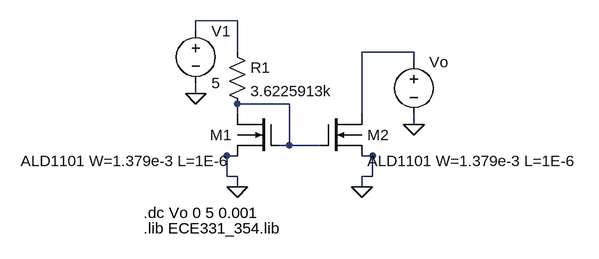
[diagram p0: schematic nmos_current_mirror_dc_out_swing.asc]
nmos_current_mirror_dc_out_swing.asc, the LTspice schematic file:
Version 4
SHEET 1 880 680
WIRE 112 -32 48 -32
WIRE 48 -16 48 -32
WIRE 112 16 112 -32
WIRE 384 16 304 16
WIRE 384 32 384 16
WIRE 48 80 48 64
WIRE 192 96 112 96
WIRE 112 112 112 96
WIRE 304 112 304 16
WIRE 384 128 384 112
WIRE 192 160 192 96
WIRE 192 160 176 160
WIRE 240 160 192 160
WIRE 112 176 96 176
WIRE 320 176 304 176
WIRE 96 208 96 176
WIRE 112 208 96 208
WIRE 320 208 320 176
WIRE 320 208 304 208
WIRE 112 224 112 208
WIRE 304 224 304 208
FLAG 304 224 0
FLAG 48 80 0
FLAG 112 224 0
FLAG 384 128 0
SYMBOL ECE331\\ALD1101 176 112 M0
SYMATTR InstName M1
SYMBOL ECE331\\ALD1101 240 112 R0
SYMATTR InstName M2
SYMBOL voltage 48 -32 R0
WINDOW 123 0 0 Left 0
WINDOW 39 0 0 Left 0
SYMATTR InstName V1
SYMATTR Value 5
SYMBOL res 96 0 R0
SYMATTR InstName R1
SYMATTR Value 3.6225913k
SYMBOL voltage 384 16 R0
WINDOW 123 0 0 Left 0
WINDOW 39 0 0 Left 0
SYMATTR InstName Vo
SYMATTR Value ""
TEXT -32 264 Left 2 !.dc Vo 0 5 0.001
TEXT -32 288 Left 2 !.lib ECE331_354.lib

The netlist it stands for:
* nmos_current_mirror_dc_out_swing.asc
M1 N003 N003 0 0 ALD1101 W=1.379e-3 L=1E-6
M2 N002 N003 0 0 ALD1101 W=1.379e-3 L=1E-6
V1 N001 0 5
R1 N001 N003 3.6225913k
Vo N002 0
.model NMOS NMOS
.model PMOS PMOS
.lib standard.mos
.dc Vo 0 5 0.001
.lib ECE331_354.lib
.backanno
.end

* Results of the author's LTspice run, read from the files saved beside the schematic
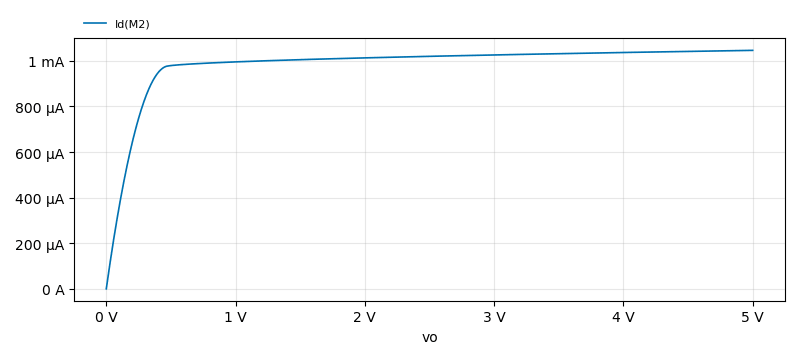
[diagram p1: DC transfer characteristic of nmos_current_mirror_dc_out_swing.asc, plotted from the saved traces]
* DC transfer characteristic, 1 run:
*   Id(M2): 0.0008952 fA at vo=0 V, 1.046 mA at vo=5 V, min 0.0008952 fA, max 1.046 mA